# EAGLE schematic threshold (EAGLE 7.5.0)

## Sheet 1 of 4: Sheet1
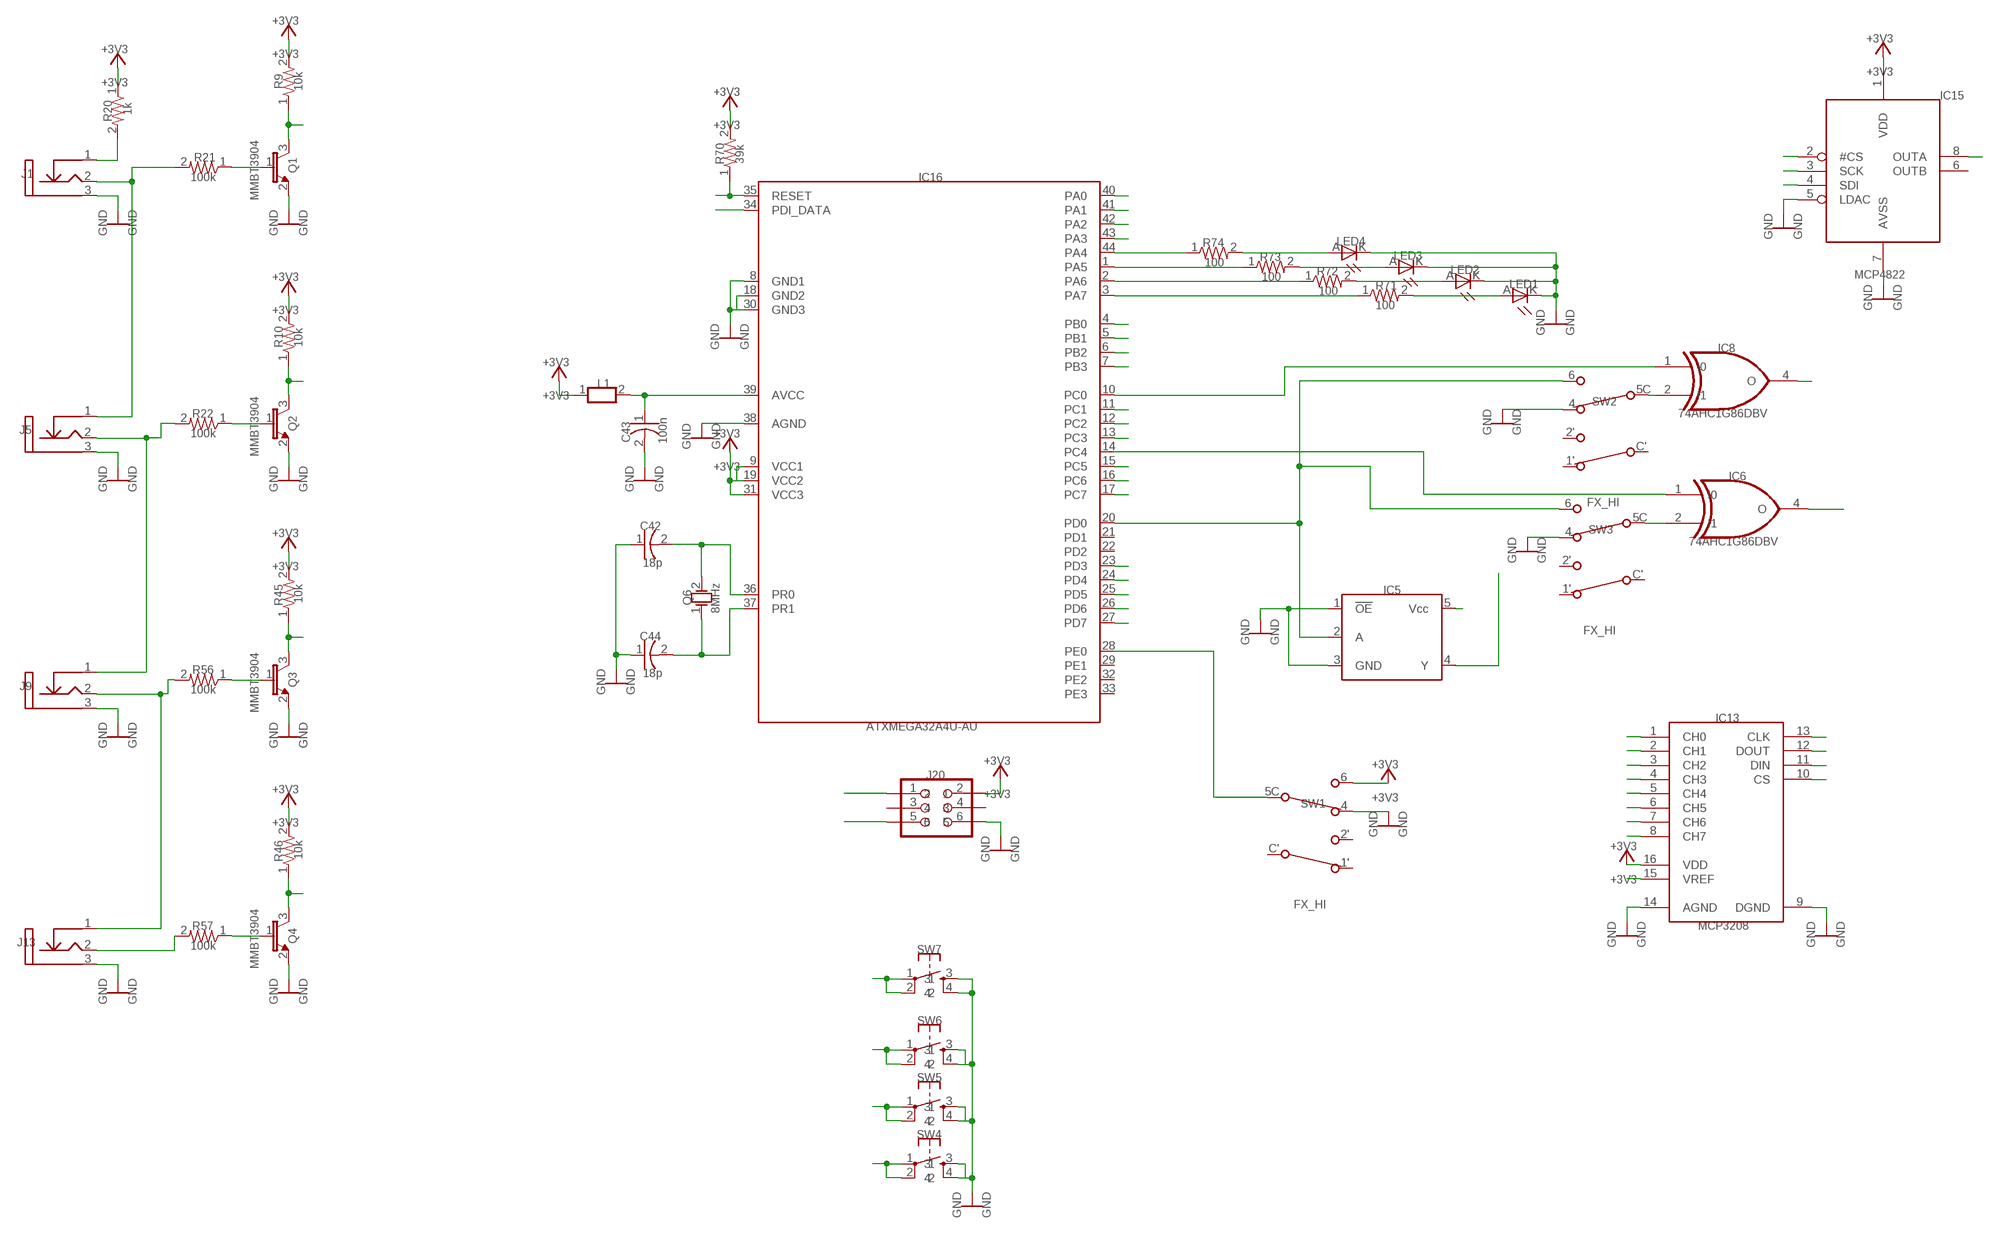
[diagram p0: schematic, sheet 1]

### Parts
C42  18p  C-USC0603_7  [CAP_0603]
C43  100n  C-USC0603  [CAP_0603]
C44  18p  C-USC0603_7  [CAP_0603]
IC5  74AHC1G125GV  [SOT23-5]
IC6  74AHC1G86DBV  [SOT23-5]
IC8  74AHC1G86DBV  [SOT23-5]
IC13  MCP3208  [SO16]
IC15  MCP4822  MCP4822SO08  [SO08]
IC16  ATXMEGA32A4U-AU  AVR_XMEGA_A4_44A  [TQFP44]
J1  THONKICONN  [THONKICONN_JACK]
J5  THONKICONN  [THONKICONN_JACK]
J9  THONKICONN  [THONKICONN_JACK]
J13  THONKICONN  [THONKICONN_JACK]
J20  AVR_SPI_PRG_6PTH  [2X3]
L1  WE-CBF_0603  [0603]
LED1  LED3MM  [LED3MM]
LED2  LED3MM  [LED3MM]
LED3  LED3MM  [LED3MM]
LED4  LED3MM  [LED3MM]
Q1  MMBT3904  MMBT3904LT1-NPN-SOT23-BEC  [SOT23]
Q2  MMBT3904  MMBT3904LT1-NPN-SOT23-BEC  [SOT23]
Q3  MMBT3904  MMBT3904LT1-NPN-SOT23-BEC  [SOT23]
Q4  MMBT3904  MMBT3904LT1-NPN-SOT23-BEC  [SOT23]
Q6  8MHz  TXC_7A_CRYSTAL  [TSC_7A_CRYSTAL]
R9  10k  R-US_R0603  [RES_0603]
R10  10k  R-US_R0603  [RES_0603]
R20  1k  R-US_R0603_31  [RES_0603]
R21  100k  R-US_R0603_33  [RES_0603]
R22  100k  R-US_R0603_33  [RES_0603]
R45  10k  R-US_R0603  [RES_0603]
R46  10k  R-US_R0603  [RES_0603]
R56  100k  R-US_R0603_33  [RES_0603]
R57  100k  R-US_R0603_33  [RES_0603]
R70  39k  R-US_R0603  [RES_0603]
R71  100  R-US_R0603_32  [RES_0603]
R72  100  R-US_R0603_32  [RES_0603]
R73  100  R-US_R0603_32  [RES_0603]
R74  100  R-US_R0603_32  [RES_0603]
SW1  FX_HI  PVB6  [PVB6I]
SW2  FX_HI  PVB6_5  [PVB6I]
SW3  FX_HI  PVB6_5  [PVB6I]
SW4  TAC_SWITCHPTH  [TACTILE-PTH]
SW5  TAC_SWITCHPTH  [TACTILE-PTH]
SW6  TAC_SWITCHPTH  [TACTILE-PTH]
SW7  TAC_SWITCHPTH  [TACTILE-PTH]

### Nets
+3V3: IC5.5(Vcc) IC13.16(VDD) IC15.1(VDD) IC16.9(VCC1) IC16.19(VCC2) IC16.31(VCC3) J20.2 L1.1 R9.2 R10.2 R20.1 R45.2 R46.2 R70.2 SW1.6(C2) ; also sheet 3,4
ADC_MISO: IC13.12(DOUT) IC16.26(PD6)
ADC_MOSI: IC13.11(DIN) IC16.25(PD5)
ADC_SCK: IC13.13(CLK) IC16.27(PD7)
ADC_SS: IC13.10(CS) IC16.23(PD3)
AREF: IC13.15(VREF) ; also sheet 3
CH1: IC13.1(CH0) ; also sheet 2
CH2: IC13.2(CH1) ; also sheet 2
CH3: IC13.5(CH4) ; also sheet 2
CH4: IC13.6(CH5) ; also sheet 2
CH5: IC13.3(CH2) ; also sheet 2
CH6: IC13.4(CH3) ; also sheet 2
CH7: IC13.7(CH6) ; also sheet 2
CH8: IC13.8(CH7) ; also sheet 2
CHANNEL1: IC5.4(Y) ; also sheet 2
CHANNEL2: IC6.4(PART_1:O) ; also sheet 2
CHANNEL3: IC8.4(PART_1:O) ; also sheet 2
CHANNEL4: IC15.8(OUTA) ; also sheet 2
DAC_MOSI: IC15.4(SDI) IC16.17(PC7)
DAC_SCK: IC15.3(SCK) IC16.15(PC5)
DAC_SS: IC15.2(#CS) IC16.16(PC6)
GATE1: IC16.40(PA0) Q1.3(C) R9.1
GATE1_IN: J1.2(Tip) J5.1(TN) R21.2
GATE1_LED: LED4.A R74.2
GATE2: IC16.41(PA1) Q2.3(C) R10.1
GATE2_IN: J5.2(Tip) J9.1(TN) R22.2
GATE2_LED: LED3.A R73.2
GATE3: IC16.42(PA2) Q3.3(C) R45.1
GATE3_IN: J9.2(Tip) J13.1(TN) R56.2
GATE3_LED: LED2.A R72.2
GATE4: IC16.43(PA3) Q4.3(C) R46.1
GATE4_IN: J13.2(Tip) R57.2
GATE4_LED: LED1.A R71.2
GND: C42.1 C43.2 C44.1 IC5.1(!OE!) IC5.3(GND) IC13.9(DGND) IC13.14(AGND) IC15.5(LDAC) IC15.7(AVSS) IC16.8(GND1) IC16.18(GND2) IC16.30(GND3) IC16.38(AGND) J1.3(GND) J5.3(GND) J9.3(GND) J13.3(GND) J20.6 LED1.K(C) LED2.K(C) LED3.K(C) LED4.K(C) Q1.2(E) Q2.2(E) Q3.2(E) Q4.2(E) SW1.4(C3) SW2.4(C3) SW3.4(C3) SW4.3 SW4.4 SW5.3 SW5.4 SW6.3 SW6.4 SW7.3 SW7.4 ; also sheet 2,3,4
MIDI_IN: IC16.12(PC2) ; also sheet 4
N$1: Q1.1(B) R21.1
N$2: Q2.1(B) R22.1
N$3: Q3.1(B) R56.1
N$5: IC16.44(PA4) R74.1
N$6: IC16.1(PA5) R73.1
N$7: IC16.2(PA6) R72.1
N$8: IC16.3(PA7) R71.1
N$12: J1.1(TN) R20.2
N$19: IC6.1(PART_1:I0) IC16.14(PC4)
N$21: IC8.2(PART_1:I1) SW2.5C(C1)
N$24: IC6.2(PART_1:I1) SW3.5C(C1)
N$39: C43.1 IC16.39(AVCC) L1.2
N$41: IC8.1(PART_1:I0) IC16.10(PC0)
N$48: IC5.2(A) IC16.20(PD0) SW2.6(C2) SW3.6(C2)
N$82: C44.2 IC16.37(PR1) Q6.1(OSC1)
N$83: C42.2 IC16.36(PR0) Q6.2(OSC2)
N$40000: Q4.1(B) R57.1
NES_TRIANGLE_CLK: IC16.24(PD4) ; also sheet 4
PDICLK: IC16.35(RESET) J20.5 R70.1
PDIDATA: IC16.34(PDI_DATA) J20.1
SW1: IC16.4(PB0) SW7.1 SW7.2
SW2: IC16.5(PB1) SW6.1 SW6.2
SW3: IC16.6(PB2) SW5.1 SW5.2
SW4: IC16.7(PB3) SW4.1 SW4.2
SW_MIDI_LEARN: IC16.11(PC1) ; also sheet 4
SW_MIDI_MODE: IC16.13(PC3) ; also sheet 4
SYNC_SWITCH: IC16.28(PE0) SW1.5C(C1)
Unconnected: IC15.6(OUTB) IC16.21(PD1) IC16.22(PD2) IC16.29(PE1) IC16.32(PE2) IC16.33(PE3) J20.3 J20.4 SW1.1'(C3) SW1.2'(C2) SW1.C'(C1) SW2.1'(C3) SW2.2'(C2) SW2.C'(C1) SW3.1'(C3) SW3.2'(C2) SW3.C'(C1)

### Notes on the sheet
- +3V3
- +3V3
- +3V3
- +3V3
- +3V3
- +3V3
- R9 | 10k
- +3V3
- IC15
- 1k
- R20 | +3V3
- R21 | R70 | 39k
- 100k | Q1
- J1
- IC16
- MMBT3904
- GND | GND | GND | GND
- GND | GND
- R74 | LED4
- 100 | R73 | LED3
- 100 | MCP4822
- R72 | LED2
- +3V3
- 100 | R71 | LED1
- 100
- +3V3
- GND | GND
- GND | GND
- R10 | 10k | GND | GND
- IC8
- +3V3
- L1
- +3V3
- SW2
- 74AHC1G86DBV
- R22
- 100k | Q2
- J5 | GND | GND
- +3V3
- C43 | 100n
- GND | GND
- MMBT3904
- +3V3
- IC6
- GND | GND | GND | GND | GND | GND
- FX_HI
- C42
- SW3
- +3V3 | 74AHC1G86DBV
- 18p
- +3V3 | GND | GND
- IC5
- R45 | 10k | Q6
- 8MHz
- FX_HI
- C44
- GND | GND
- 18p
- R56
- 100k | Q3
- J9
- GND | GND
- MMBT3904
- ATXMEGA32A4U-AU | IC13
- GND | GND | GND | GND
- +3V3
- +3V3
- J20
- +3V3
- +3V3 | +3V3
- SW1
- +3V3
- GND | GND
- +3V3
- R46 | 10k | GND | GND
- +3V3
- FX_HI
- MCP3208
- R57
- 100k | Q4
- J13 | GND | GND | GND | GND
- SW7
- MMBT3904
- GND | GND | GND | GND
- SW6
- SW5
- SW4
- GND | GND

## Sheet 2 of 4: Sheet2
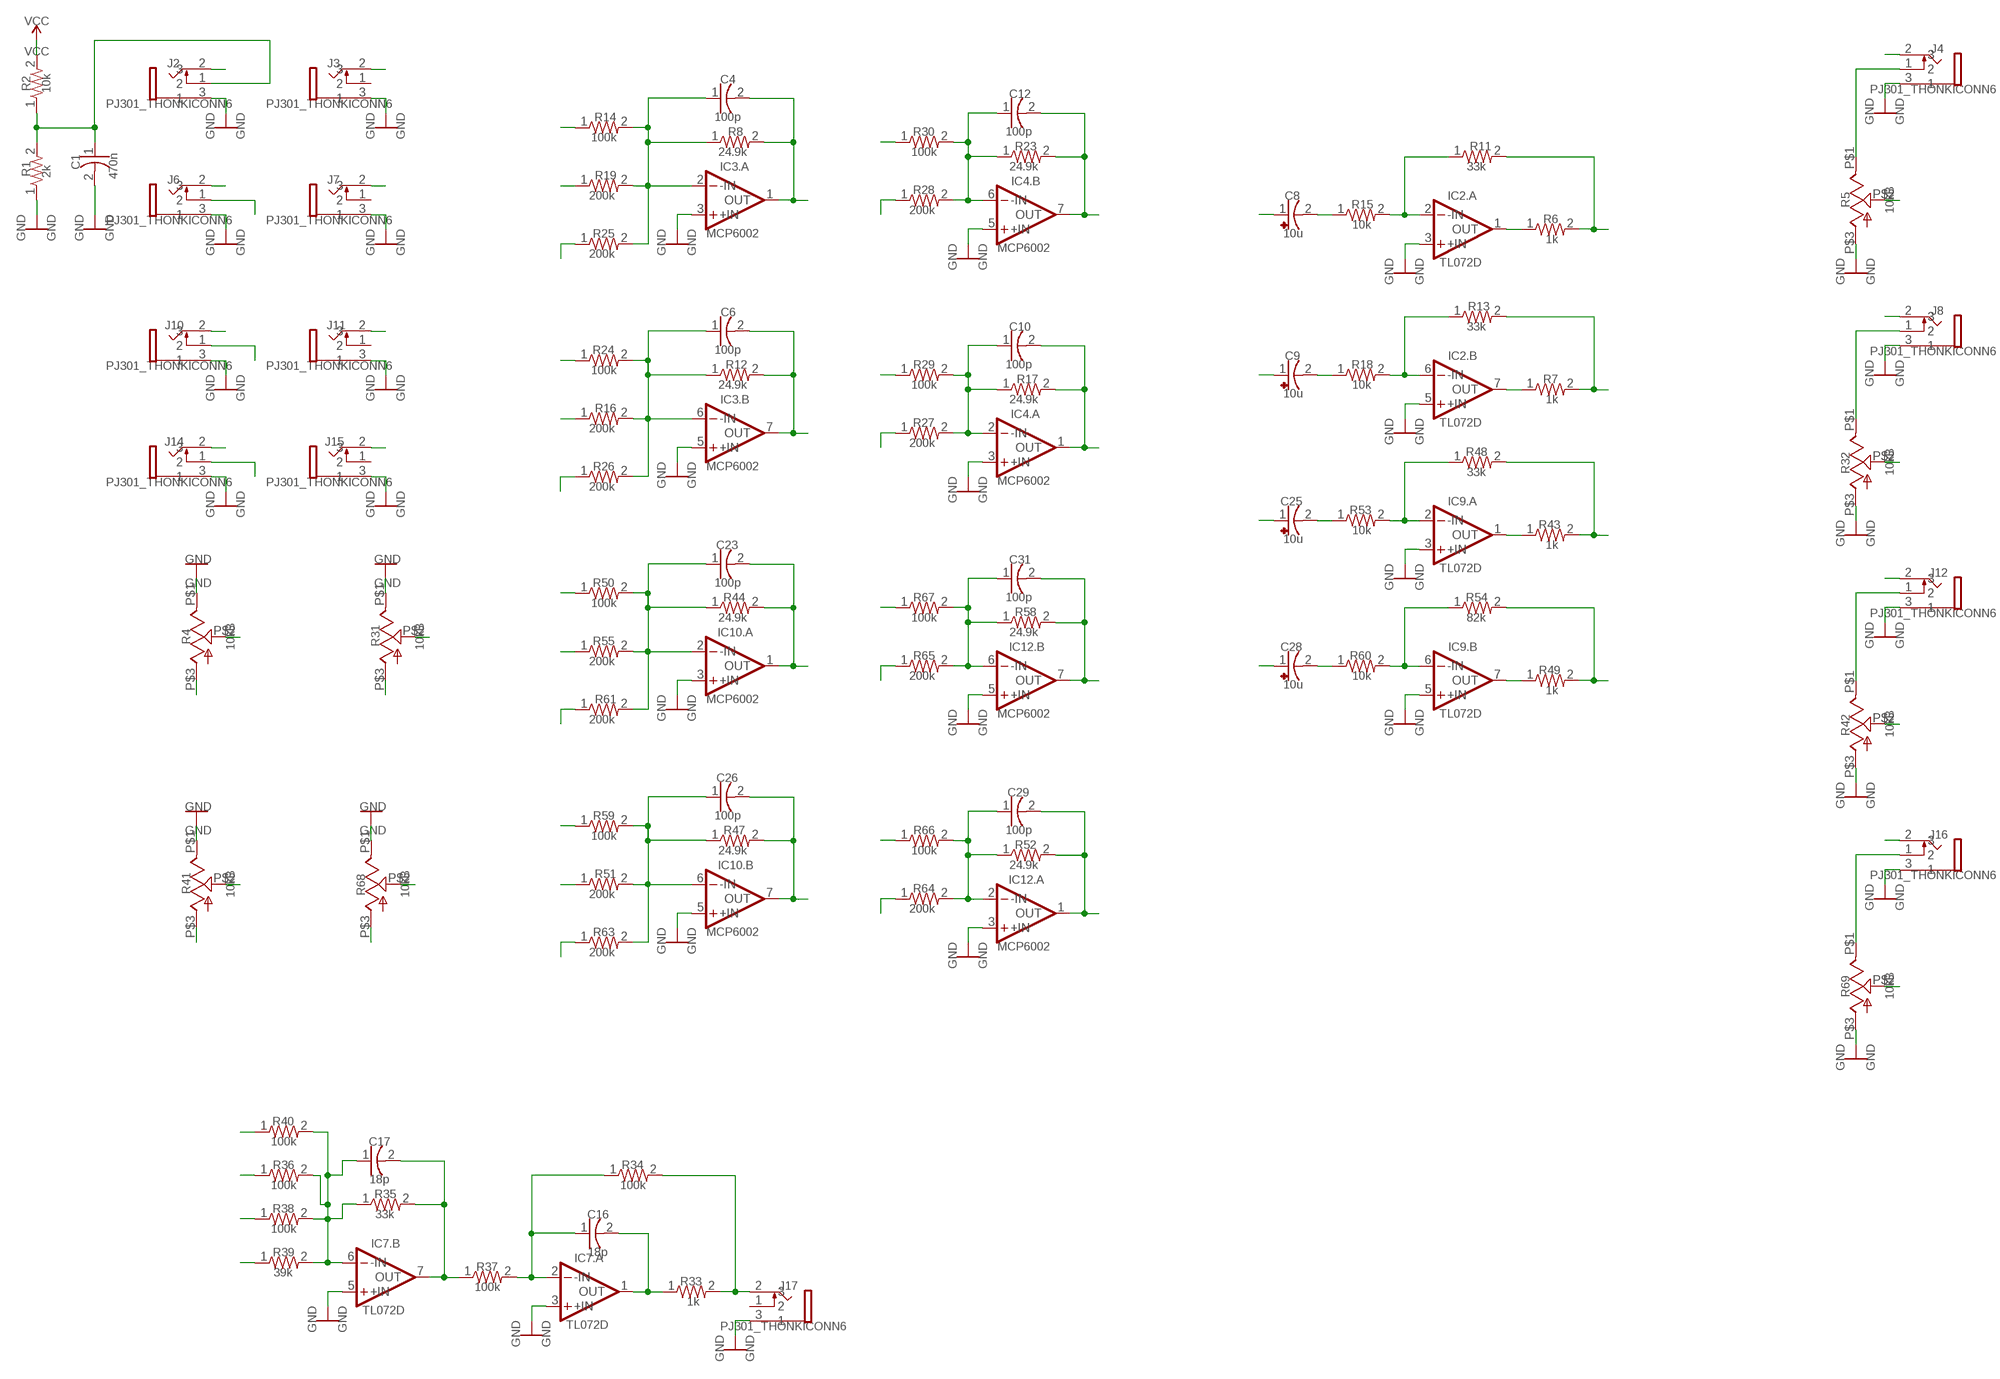
[diagram p1: schematic, sheet 2]

### Parts
C1  470n  C-USC0603  [CAP_0603]
C4  100p  C-USC0603_7  [CAP_0603]
C6  100p  C-USC0603_7  [CAP_0603]
C8  10u  CPOL-USB  [CAP_1206]
C9  10u  CPOL-USB  [CAP_1206]
C10  100p  C-USC0603_7  [CAP_0603]
C12  100p  C-USC0603_7  [CAP_0603]
C16  18p  C-USC0603_7  [CAP_0603]
C17  18p  C-USC0603_7  [CAP_0603]
C23  100p  C-USC0603_7  [CAP_0603]
C25  10u  CPOL-USB  [CAP_1206]
C26  100p  C-USC0603_7  [CAP_0603]
C28  10u  CPOL-USB  [CAP_1206]
C29  100p  C-USC0603_7  [CAP_0603]
C31  100p  C-USC0603_7  [CAP_0603]
IC2  TL072D  [SO08_23]
IC3  MCP6002  TL072D  [SO08_23]
IC4  MCP6002  TL072D  [SO08_23]
IC7  TL072D  [SO08_23]
IC9  TL072D  [SO08_23]
IC10  MCP6002  TL072D  [SO08_23]
IC12  MCP6002  TL072D  [SO08_23]
J2  PJ301_THONKICONN6  [THONKICONN]
J3  PJ301_THONKICONN6  [THONKICONN]
J4  PJ301_THONKICONN6  PJ301_THONKICONN6_1  [THONKICONN]
J6  PJ301_THONKICONN6  [THONKICONN]
J7  PJ301_THONKICONN6  [THONKICONN]
J8  PJ301_THONKICONN6  PJ301_THONKICONN6_1  [THONKICONN]
J10  PJ301_THONKICONN6  [THONKICONN]
J11  PJ301_THONKICONN6  [THONKICONN]
J12  PJ301_THONKICONN6  PJ301_THONKICONN6_1  [THONKICONN]
J14  PJ301_THONKICONN6  [THONKICONN]
J15  PJ301_THONKICONN6  [THONKICONN]
J16  PJ301_THONKICONN6  PJ301_THONKICONN6_1  [THONKICONN]
J17  PJ301_THONKICONN6  PJ301_THONKICONN6_1  [THONKICONN]
R1  2k  R-US_R0603  [RES_0603]
R2  10k  R-US_R0603  [RES_0603]
R4  10kB  POT_USVERTICAL_PS  [ALPS_POT_VERTICAL_PS]
R5  10kB  POT_USVERTICAL_PS  [ALPS_POT_VERTICAL_PS]
R6  1k  R-US_R0603_32  [RES_0603]
R7  1k  R-US_R0603_32  [RES_0603]
R8  24.9k  R-US_R0603_32  [RES_0603]
R11  33k  R-US_R0603_32  [RES_0603]
R12  24.9k  R-US_R0603_32  [RES_0603]
R13  33k  R-US_R0603_32  [RES_0603]
R14  100k  R-US_R0603_32  [RES_0603]
R15  10k  R-US_R0603_32  [RES_0603]
R16  200k  R-US_R0603_32  [RES_0603]
R17  24.9k  R-US_R0603_32  [RES_0603]
R18  10k  R-US_R0603_32  [RES_0603]
R19  200k  R-US_R0603_32  [RES_0603]
R23  24.9k  R-US_R0603_32  [RES_0603]
R24  100k  R-US_R0603_32  [RES_0603]
R25  200k  R-US_R0603_32  [RES_0603]
R26  200k  R-US_R0603_32  [RES_0603]
R27  200k  R-US_R0603_32  [RES_0603]
R28  200k  R-US_R0603_32  [RES_0603]
R29  100k  R-US_R0603_32  [RES_0603]
R30  100k  R-US_R0603_32  [RES_0603]
R31  10kB  POT_USVERTICAL_PS  [ALPS_POT_VERTICAL_PS]
R32  10kB  POT_USVERTICAL_PS  [ALPS_POT_VERTICAL_PS]
R33  1k  R-US_R0603_32  [RES_0603]
R34  100k  R-US_R0603_32  [RES_0603]
R35  33k  R-US_R0603_32  [RES_0603]
R36  100k  R-US_R0603_32  [RES_0603]
R37  100k  R-US_R0603_32  [RES_0603]
R38  100k  R-US_R0603_32  [RES_0603]
R39  39k  R-US_R0603_32  [RES_0603]
R40  100k  R-US_R0603_32  [RES_0603]
R41  10kB  POT_USVERTICAL_PS  [ALPS_POT_VERTICAL_PS]
R42  10kB  POT_USVERTICAL_PS  [ALPS_POT_VERTICAL_PS]
R43  1k  R-US_R0603_32  [RES_0603]
R44  24.9k  R-US_R0603_32  [RES_0603]
R47  24.9k  R-US_R0603_32  [RES_0603]
R48  33k  R-US_R0603_32  [RES_0603]
R49  1k  R-US_R0603_32  [RES_0603]
R50  100k  R-US_R0603_32  [RES_0603]
R51  200k  R-US_R0603_32  [RES_0603]
R52  24.9k  R-US_R0603_32  [RES_0603]
R53  10k  R-US_R0603_32  [RES_0603]
R54  82k  R-US_R0603_32  [RES_0603]
R55  200k  R-US_R0603_32  [RES_0603]
R58  24.9k  R-US_R0603_32  [RES_0603]
R59  100k  R-US_R0603_32  [RES_0603]
R60  10k  R-US_R0603_32  [RES_0603]
R61  200k  R-US_R0603_32  [RES_0603]
R63  200k  R-US_R0603_32  [RES_0603]
R64  200k  R-US_R0603_32  [RES_0603]
R65  200k  R-US_R0603_32  [RES_0603]
R66  100k  R-US_R0603_32  [RES_0603]
R67  100k  R-US_R0603_32  [RES_0603]
R68  10kB  POT_USVERTICAL_PS  [ALPS_POT_VERTICAL_PS]
R69  10kB  POT_USVERTICAL_PS  [ALPS_POT_VERTICAL_PS]

### Nets
AREF_-10: R4.P$3(A) R25.1 R26.1 R27.1 R28.1 R31.P$3(A) R41.P$3(A) R61.1 R63.1 R64.1 R65.1 R68.P$3(A) ; also sheet 3
CH1: C4.2 IC3.1(PART_A:OUT) R8.2 ; also sheet 1
CH2: C6.2 IC3.7(PART_B:OUT) R12.2 ; also sheet 1
CH3: C23.2 IC10.1(PART_A:OUT) R44.2 ; also sheet 1
CH4: C26.2 IC10.7(PART_B:OUT) R47.2 ; also sheet 1
CH5: C12.2 IC4.7(PART_B:OUT) R23.2 ; also sheet 1
CH6: C10.2 IC4.1(PART_A:OUT) R17.2 ; also sheet 1
CH7: C31.2 IC12.7(PART_B:OUT) R58.2 ; also sheet 1
CH8: C29.2 IC12.1(PART_A:OUT) R52.2 ; also sheet 1
CHANNEL1: C8.1(+) ; also sheet 1
CHANNEL1_BUFFERED: J4.2 R6.2 R11.2
CHANNEL1_RETURN: R5.P$2(S) R40.1
CHANNEL2: C9.1(+) ; also sheet 1
CHANNEL2_BUFFERED: J8.2 R7.2 R13.2
CHANNEL2_RETURN: R32.P$2(S) R36.1
CHANNEL3: C25.1(+) ; also sheet 1
CHANNEL3_BUFFERED: J12.2 R43.2 R48.2
CHANNEL3_RETURN: R38.1 R42.P$2(S)
CHANNEL4: C28.1(+) ; also sheet 1
CHANNEL4_BUFFERED: J16.2 R49.2 R54.2
CHANNEL4_RETURN: R39.1 R69.P$2(S)
COARSE1: R4.P$2(S) R19.1
COARSE2: R16.1 R31.P$2(S)
COARSE3: R41.P$2(S) R55.1
COARSE4: R51.1 R68.P$2(S)
CV1: J2.2 J6.1 R14.1
CV2: J6.2 J10.1 R24.1
CV3: J10.2 J14.1 R50.1
CV4: J14.2 R59.1
FM1: J3.2 R30.1
FM2: J7.2 R29.1
FM3: J11.2 R67.1
FM4: J15.2 R66.1
GND: C1.2 IC2.3(PART_A:+IN) IC2.5(PART_B:+IN) IC3.3(PART_A:+IN) IC3.5(PART_B:+IN) IC4.3(PART_A:+IN) IC4.5(PART_B:+IN) IC7.3(PART_A:+IN) IC7.5(PART_B:+IN) IC9.3(PART_A:+IN) IC9.5(PART_B:+IN) IC10.3(PART_A:+IN) IC10.5(PART_B:+IN) IC12.3(PART_A:+IN) IC12.5(PART_B:+IN) J2.3 J3.3 J4.3 J6.3 J7.3 J8.3 J10.3 J11.3 J12.3 J14.3 J15.3 J16.3 J17.3 R1.1 R4.P$1(E) R5.P$3(A) R31.P$1(E) R32.P$3(A) R41.P$1(E) R42.P$3(A) R68.P$1(E) R69.P$3(A) ; also sheet 1,3,4
MIX: J17.2 R33.2 R34.2
N$4: J8.1 R32.P$1(E)
N$9: C23.1 IC10.2(PART_A:-IN) R44.1 R50.2 R55.2 R61.2
N$11: C10.1 IC4.2(PART_A:-IN) R17.1 R27.2 R29.2
N$13: C26.1 IC10.6(PART_B:-IN) R47.1 R51.2 R59.2 R63.2
N$15: C31.1 IC12.6(PART_B:-IN) R58.1 R65.2 R67.2
N$18: C29.1 IC12.2(PART_A:-IN) R52.1 R64.2 R66.2
N$20: C8.2(-) R15.1
N$22: IC2.2(PART_A:-IN) R11.1 R15.2
N$23: IC2.1(PART_A:OUT) R6.1
N$25: C9.2(-) R18.1
N$26: IC2.6(PART_B:-IN) R13.1 R18.2
N$27: IC2.7(PART_B:OUT) R7.1
N$28: C25.2(-) R53.1
N$29: C12.1 IC4.6(PART_B:-IN) R23.1 R28.2 R30.2
N$30: IC9.2(PART_A:-IN) R48.1 R53.2
N$31: IC9.1(PART_A:OUT) R43.1
N$32: C28.2(-) R60.1
N$33: IC9.6(PART_B:-IN) R54.1 R60.2
N$34: IC9.7(PART_B:OUT) R49.1
N$35: C17.1 IC7.6(PART_B:-IN) R35.1 R36.2 R38.2 R39.2 R40.2
N$36: C16.1 IC7.2(PART_A:-IN) R34.1 R37.2
N$37: C16.2 IC7.1(PART_A:OUT) R33.1
N$40: J4.1 R5.P$1(E)
N$42: C17.2 IC7.7(PART_B:OUT) R35.2 R37.1
N$43: J12.1 R42.P$1(E)
N$44: J16.1 R69.P$1(E)
N$45: C6.1 IC3.6(PART_B:-IN) R12.1 R16.2 R24.2 R26.2
N$46: C1.1 J2.1 R1.2 R2.1
N$50: C4.1 IC3.2(PART_A:-IN) R8.1 R14.2 R19.2 R25.2
VCC: R2.2 ; also sheet 3,4
Unconnected: J3.1 J7.1 J11.1 J15.1 J17.1

### Notes on the sheet
- VCC
- VCC
- J4
- J2 | J3
- C4 | PJ301_THONKICONN6
- R2 | 10k
- PJ301_THONKICONN6 | PJ301_THONKICONN6 | C12
- 100p
- R14 | GND | GND
- 100p
- 100k | R8 | R30
- GND | GND | GND | GND
- 24.9k | 100k | R23 | R11
- 24.9k | 33k
- C1 | IC3.A
- R1 | 2k | 470n
- R19
- J6 | J7 | IC4.B
- 200k | R28
- C8 | IC2.A
- 200k | R15 | R5
- PJ301_THONKICONN6 | PJ301_THONKICONN6 | 10kB
- 10k | R6
- MCP6002 | 10u
- R25 | 1k
- GND | GND | GND | GND | MCP6002
- 200k
- GND | GND | GND | GND | GND | GND | TL072D
- GND | GND
- GND | GND | GND | GND
- R13
- C6 | J8
- 33k
- J10 | J11 | C10
- 100p | PJ301_THONKICONN6
- R24
- PJ301_THONKICONN6 | PJ301_THONKICONN6 | 100p | C9 | IC2.B
- 100k | R12 | R29 | R18
- 24.9k | 100k | R17 | 10k | R7
- 10u | GND | GND
- 24.9k | 1k
- GND | GND | GND | GND | IC3.B
- R16
- IC4.A | TL072D
- 200k | R27
- 200k
- J14 | J15 | GND | GND
- R48
- MCP6002
- R26 | 33k
- MCP6002 | R32 | 10kB
- PJ301_THONKICONN6 | PJ301_THONKICONN6
- 200k
- GND | GND
- GND | GND | C25 | IC9.A
- GND | GND | GND | GND | R53
- 10k | R43
- 10u
- 1k
- C23 | GND | GND
- GND | GND | C31 | TL072D
- GND | GND | 100p | J12
- R50 | GND | GND
- 100p
- 100k | R44 | R67 | R54
- PJ301_THONKICONN6
- 24.9k | 100k | R58 | 82k
- 24.9k
- IC10.A
- R4 | R31 | R55
- 10kB | 10kB | IC12.B | C28 | IC9.B | GND | GND
- 200k | R65 | R60
- 200k | 10k | R49
- 10u
- 1k
- MCP6002
- R61
- MCP6002 | TL072D
- 200k
- GND | GND
- GND | GND | GND | GND | R42 | 10kB
- C26
- C29
- GND | GND | 100p | GND | GND
- R59
- GND | GND | 100p
- 100k | R47 | R66
- J16
- 24.9k | 100k | R52
- 24.9k
- IC10.B | PJ301_THONKICONN6
- R51
- IC12.A
- 200k | R64
- R41 | R68
- 10kB | 10kB
- 200k
- GND | GND
- MCP6002
- R63
- MCP6002
- 200k
- GND | GND
- GND | GND
- R69 | 10kB
- GND | GND
- R40
- 100k
- C17
- R36 | R34
- 18p
- 100k | 100k
- R35
- R38 | 33k
- C16
- 100k
- IC7.B | 18p
- R39
- IC7.A
- 39k | R37
- 100k | R33
- J17
- 1k
- TL072D
- TL072D | PJ301_THONKICONN6
- GND | GND
- GND | GND
- GND | GND

## Sheet 3 of 4: Sheet3
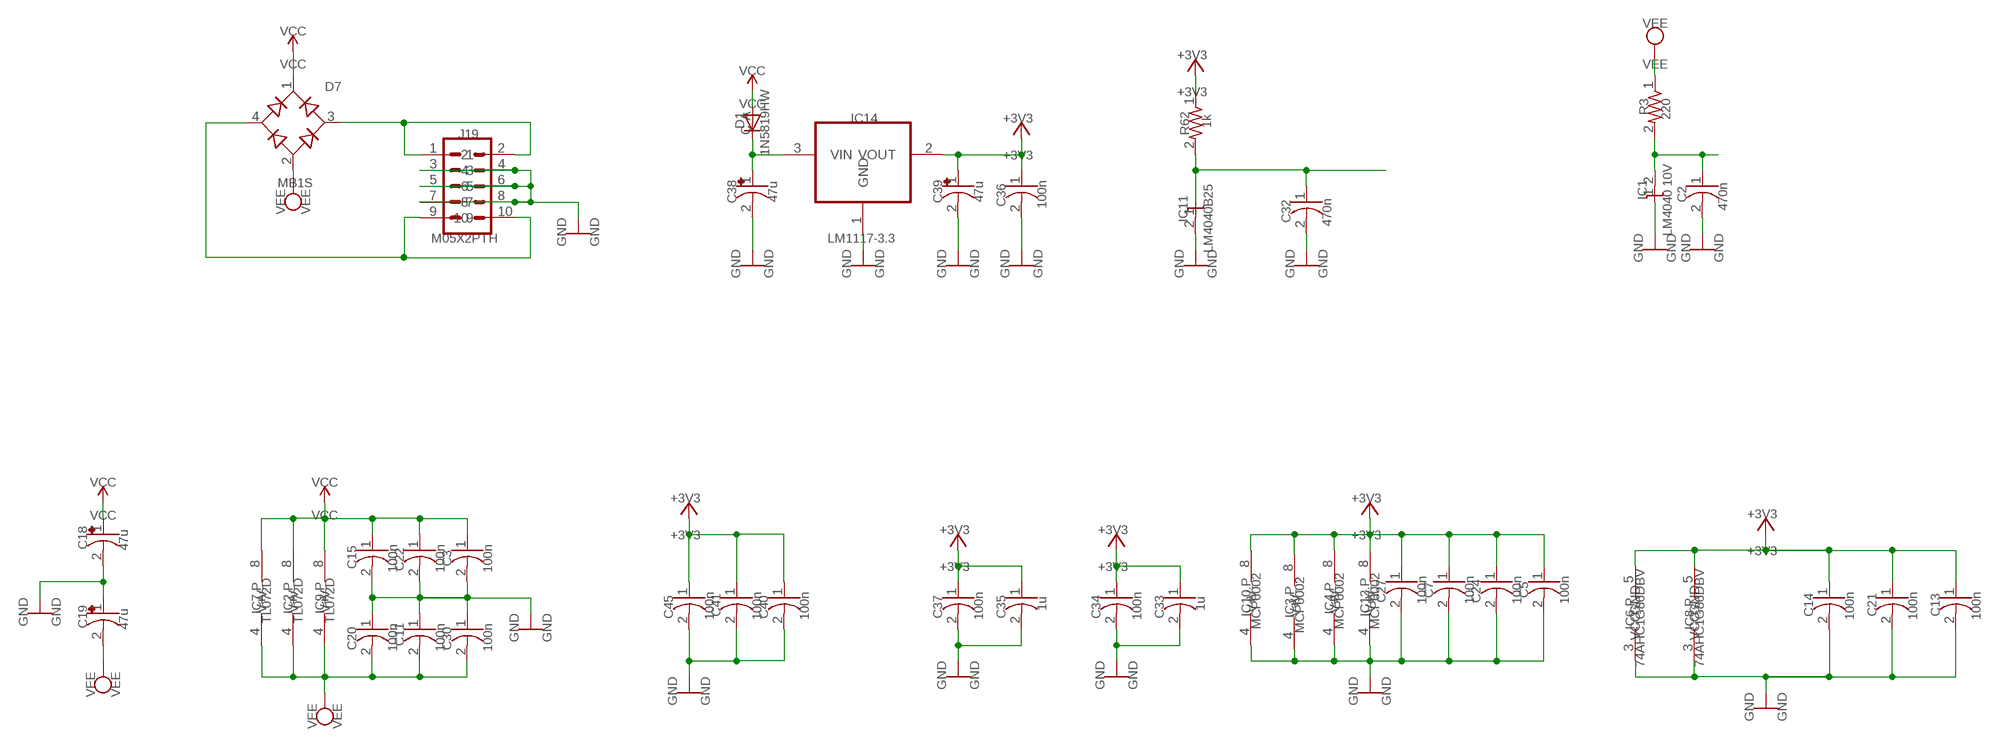
[diagram p2: schematic, sheet 3]

### Parts
C2  470n  C-USC0603  [CAP_0603]
C3  100n  C-USC0603  [CAP_0603]
C5  100n  C-USC0603  [CAP_0603]
C7  100n  C-USC0603  [CAP_0603]
C11  100n  C-USC0603  [CAP_0603]
C13  100n  C-USC0603  [CAP_0603]
C14  100n  C-USC0603  [CAP_0603]
C15  100n  C-USC0603  [CAP_0603]
C18  47u  EEE-FT1V470AR  [CAPAE-5.3X5.3H7]
C19  47u  EEE-FT1V470AR  [CAPAE-5.3X5.3H7]
C20  100n  C-USC0603  [CAP_0603]
C21  100n  C-USC0603  [CAP_0603]
C22  100n  C-USC0603  [CAP_0603]
C24  100n  C-USC0603  [CAP_0603]
C27  100n  C-USC0603  [CAP_0603]
C30  100n  C-USC0603  [CAP_0603]
C32  470n  C-USC0603  [CAP_0603]
C33  1u  C-USC0603  [CAP_0603]
C34  100n  C-USC0603  [CAP_0603]
C35  1u  C-USC0603  [CAP_0603]
C36  100n  C-USC0603  [CAP_0603]
C37  100n  C-USC0603  [CAP_0603]
C38  47u  EEE-FT1V470AR  [CAPAE-5.3X5.3H7]
C39  47u  EEE-FT1V470AR  [CAPAE-5.3X5.3H7]
C40  100n  C-USC0603  [CAP_0603]
C41  100n  C-USC0603  [CAP_0603]
C45  100n  C-USC0603  [CAP_0603]
D1  1N5819HW  DIODE-SOD123  [SOD123]
D7  MB1S  [SOP-4/6.5X2.54]
IC1  LM4040 10V  LM4041C12DBZ  [SOT23]
IC11  LM4040B25  LM4041B12DBZ  [SOT23]
IC14  LM1117-3.3  REG1117  [SOT223]
J19  M05X2PTH  [AVR_ICSP]
R3  220  R-US_R0603_31  [RES_0603]
R62  1k  R-US_R0603_31  [RES_0603]

### Nets
+3V3: C5.1 C7.1 C13.1 C14.1 C21.1 C24.1 C27.1 C33.1 C34.1 C35.1 C36.1 C37.1 C39.1(+) C40.1 C41.1 C45.1 IC3.8(PART_P:V+) IC4.8(PART_P:V+) IC6.5(PART_P:VCC) IC8.5(PART_P:VCC) IC10.8(PART_P:V+) IC12.8(PART_P:V+) IC14.2(VOUT) R62.1 ; also sheet 1,4
AREF: C32.1 IC11.1(C) R62.2 ; also sheet 1
AREF_-10: C2.1 IC1.2(A) R3.2 ; also sheet 2
GND: C2.2 C3.2 C5.2 C7.2 C11.1 C13.2 C14.2 C15.2 C18.2(-) C19.1(+) C20.1 C21.2 C22.2 C24.2 C27.2 C30.1 C32.2 C33.2 C34.2 C35.2 C36.2 C37.2 C38.2(-) C39.2(-) C40.2 C41.2 C45.2 IC1.1(C) IC3.4(PART_P:V-) IC4.4(PART_P:V-) IC6.3(PART_P:GND) IC8.3(PART_P:GND) IC10.4(PART_P:V-) IC11.2(A) IC12.4(PART_P:V-) IC14.1(GND) J19.3 J19.4 J19.5 J19.6 J19.7 J19.8 ; also sheet 1,2,4
N$38: C38.1(+) D1.C IC14.3(VIN)
Net_101: D7.3(AC2) J19.1 J19.2
Net_139: D7.4(AC1) J19.9 J19.10
VCC: C3.1 C15.1 C18.1(+) C22.1 D1.A D7.1(+) IC2.8(PART_P:V+) IC7.8(PART_P:V+) IC9.8(PART_P:V+) ; also sheet 2,4
VEE: C11.2 C19.2(-) C20.2 C30.2 D7.2(-) IC2.4(PART_P:V-) IC7.4(PART_P:V-) IC9.4(PART_P:V-) R3.1 ; also sheet 4

### Notes on the sheet
- VEE
- VCC
- VCC | +3V3 | VEE
- VCC
- +3V3
- D7
- VCC
- R3
- IC14 | +3V3 | 220
- D1 | 1k
- J19 | R62
- +3V3
- 1N5819HW
- MB1S
- C38 | 47u | C39 | 47u | IC1 | C2
- C36 | 100n
- 470n
- VEE | VEE
- IC11 | C32
- 470n
- M05X2PTH | LM1117-3.3 | LM4040 10V
- GND | GND
- LM4040B25
- GND | GND | GND | GND
- GND | GND | GND | GND | GND | GND | GND | GND | GND | GND | GND | GND
- VCC | VCC
- +3V3 | +3V3
- VCC | VCC
- +3V3
- +3V3 | +3V3
- +3V3 | +3V3
- C18 | +3V3
- 47u
- +3V3 | +3V3
- C15 | C3
- 100n | C22 | 100n | 100n
- C7 | C5
- C27 | 100n | 100n | C24 | 100n | 100n
- IC7.P | IC2.P | IC9.P | 1u | 1u | IC4.P
- C45 | C41 | C40 | C37 | C35 | C34 | C33 | IC10.P | IC3.P | IC12.P | C14 | C21 | C13
- TL072D | TL072D | TL072D | 100n | 100n | 100n | 100n | 100n | 100n | 100n | 100n
- GND | GND | C19 | 47u | MCP6002 | MCP6002 | MCP6002 | IC6.P | IC8.P
- MCP6002
- GND | GND
- C11
- C20 | 100n | 100n | C30 | 100n
- 74AHC1G86DBV | 74AHC1G86DBV
- GND | GND | GND | GND
- VEE | VEE
- GND | GND | GND | GND
- GND | GND
- VEE | VEE

## Sheet 4 of 4: xpand
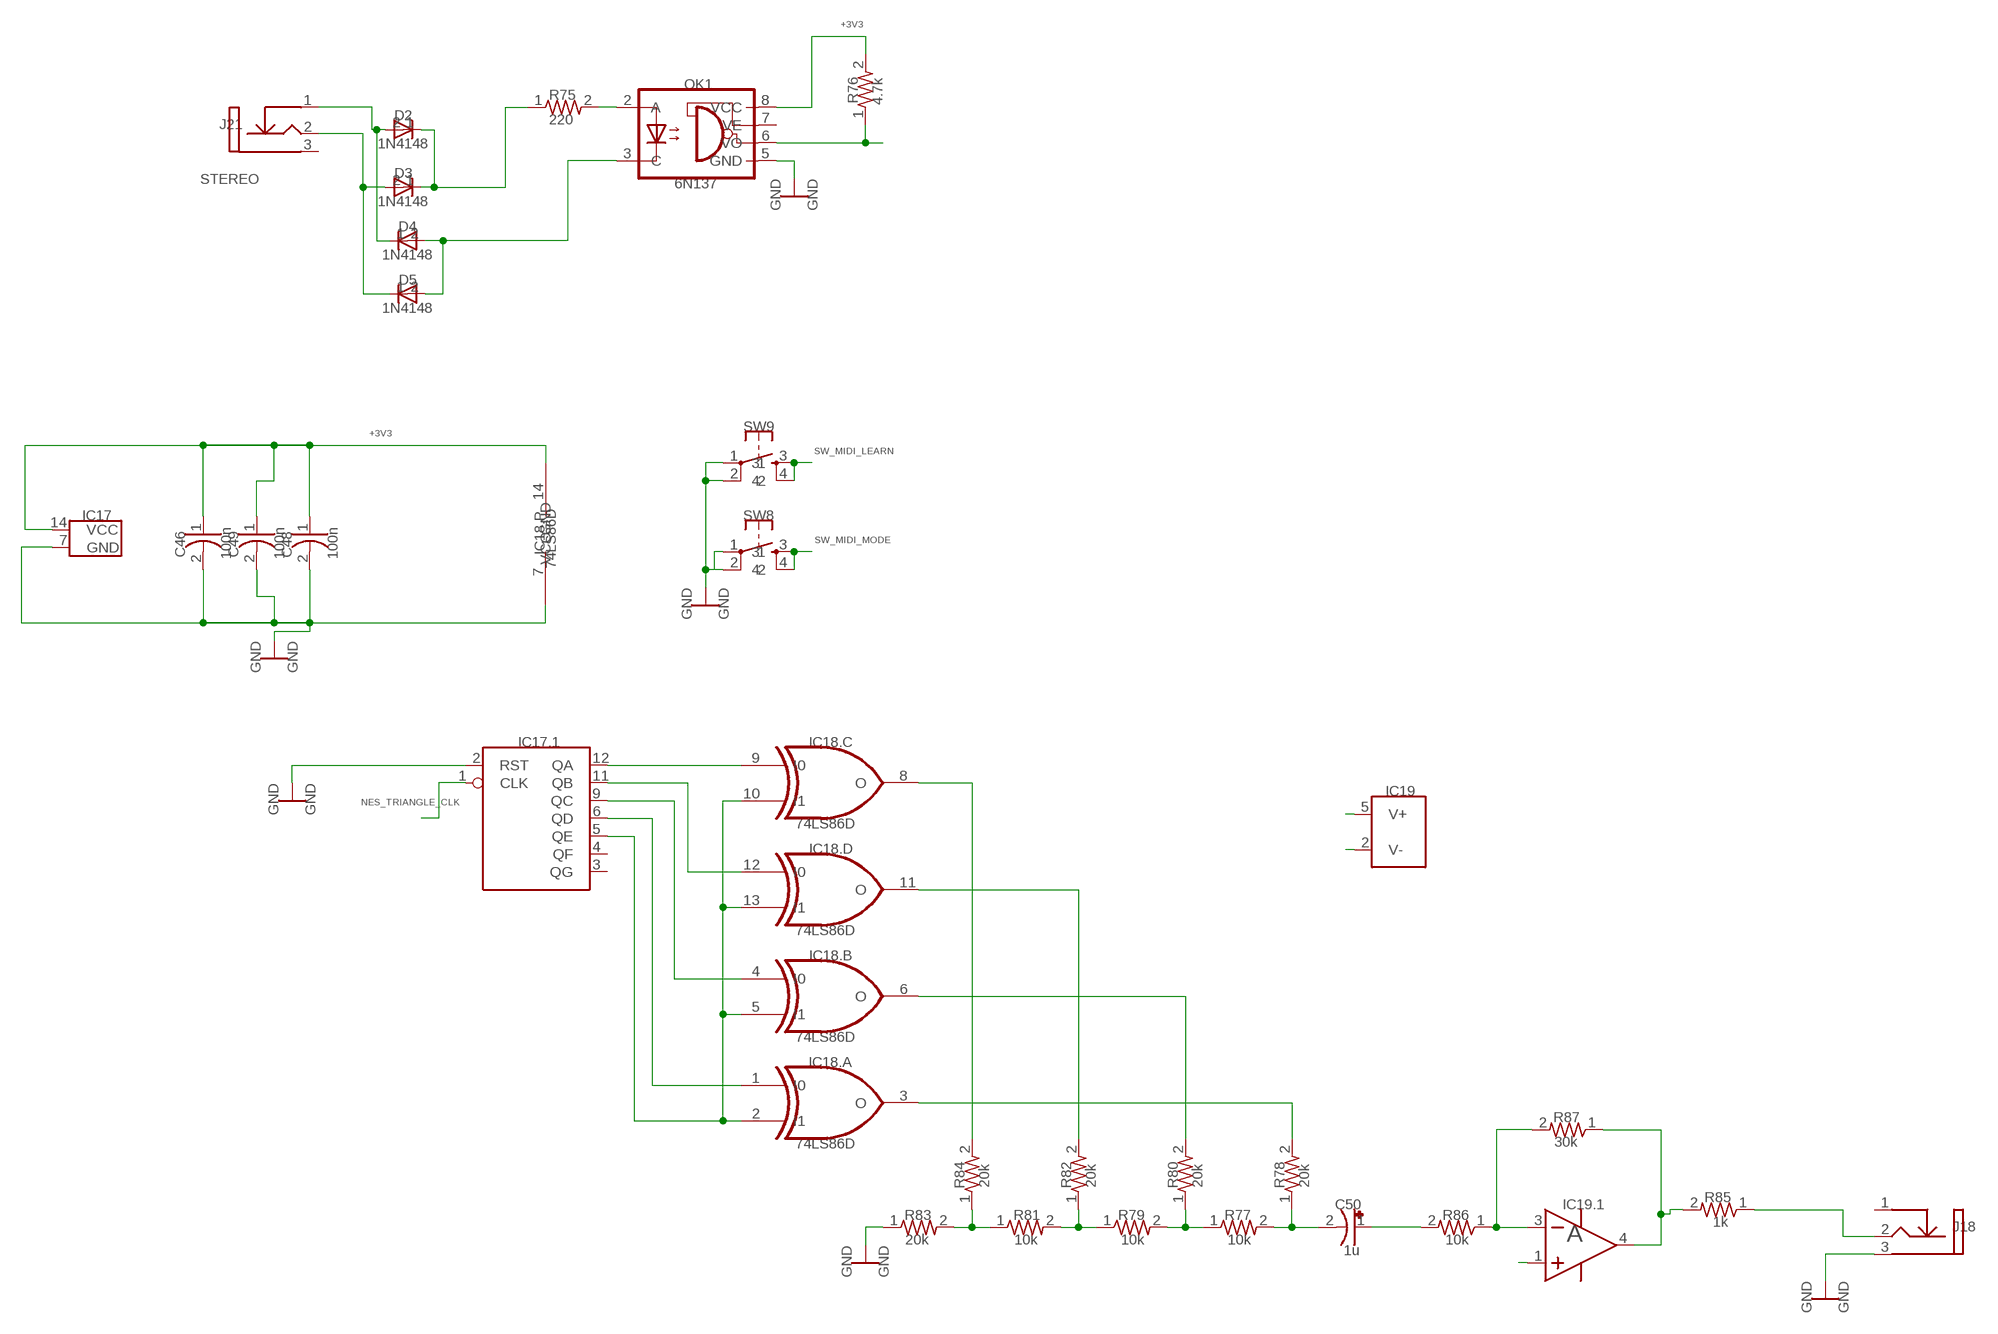
[diagram p3: schematic, sheet 4]

### Parts
C46  100n  C-USC0603  [CAP_0603]
C48  100n  C-USC0603  [CAP_0603]
C49  100n  C-USC0603  [CAP_0603]
C50  1u  CPOL-USB_26  [CAP_0805]
D2  1N4148  DIODE-SOD123_16  [SOD-123F]
D3  1N4148  DIODE-SOD123_16  [SOD-123F]
D4  1N4148  DIODE-SOD123_16  [SOD-123F]
D5  1N4148  DIODE-SOD123_16  [SOD-123F]
IC17  M74HC4024M1R  [SOIC-14/150MIL]
IC18  74LS86D  [SOIC-14/150MIL]
IC19  LM321MF  [SOT23-5]
J18  THONKICONN_35  [THONKICONN_JACK]
J21  STEREO  THONKICONN  [THONKICONN_JACK]
OK1  6N137  6N137SMT  [SOIC-8/150MIL]
R75  220  R-US_R0603_32  [RES_0603]
R76  4.7k  R-US_R0603  [RES_0603]
R77  10k  R-US_R0603_32  [RES_0603]
R78  20k  R-US_R0603  [RES_0603]
R79  10k  R-US_R0603_32  [RES_0603]
R80  20k  R-US_R0603  [RES_0603]
R81  10k  R-US_R0603_32  [RES_0603]
R82  20k  R-US_R0603  [RES_0603]
R83  20k  R-US_R0603_32  [RES_0603]
R84  20k  R-US_R0603  [RES_0603]
R85  1k  R-US_R0603_33  [RES_0603]
R86  10k  R-US_R0603_33  [RES_0603]
R87  30k  R-US_R0603_33  [RES_0603]
SW8  TAC_SWITCHPTH  [TACTILE-PTH]
SW9  TAC_SWITCHPTH  [TACTILE-PTH]

### Nets
+3V3: C46.1 C48.1 C49.1 IC17.14(VCC_AND_GND:VCC) IC18.14(PART_P:VCC) OK1.8(VCC) R76.2 ; also sheet 1,3
GND: C46.2 C48.2 C49.2 IC17.2(PART_1:RST) IC17.7(VCC_AND_GND:GND) IC18.7(PART_P:GND) IC19.1(PART_1:IN+) J18.3(GND) OK1.5(GND) R83.1 SW8.1 SW8.2 SW9.1 SW9.2 ; also sheet 1,2,3
MIDI_IN: OK1.6(VO) R76.1 ; also sheet 1
N$49: IC17.5(PART_1:QE) IC18.2(PART_A:I1) IC18.5(PART_B:I1) IC18.10(PART_C:I1) IC18.13(PART_D:I1)
N$51: IC17.11(PART_1:QB) IC18.12(PART_D:I0)
N$52: IC17.12(PART_1:QA) IC18.9(PART_C:I0)
N$56: IC17.6(PART_1:QD) IC18.1(PART_A:I0)
N$58: R81.1 R83.2 R84.1
N$59: R79.1 R81.2 R82.1
N$60: R77.1 R79.2 R80.1
N$61: C50.2(-) R77.2 R78.1
N$64: J18.2(Tip) R85.1
NES_TRIANGLE_CLK: IC17.1(PART_1:CLK) ; also sheet 1
Net_0: IC19.3(PART_1:IN-) R86.1 R87.2
Net_1: C50.1(+) R86.2
Net_56: D4.2(A) D5.2(A) OK1.3(C)
Net_57: D2.1(C) D3.1(C) R75.1
Net_113: D2.2(A) D4.1(C) J21.1(TN)
Net_131: IC18.6(PART_B:O) R80.2
Net_132: IC18.3(PART_A:O) R78.2
Net_133: IC18.11(PART_D:O) R82.2
Net_134: IC18.8(PART_C:O) R84.2
Net_135: IC19.4(PART_1:OUT) R85.2 R87.1
Net_136: D3.2(A) D5.1(C) J21.2(Tip)
Net_137: OK1.2(A) R75.2
Net_138: IC17.9(PART_1:QC) IC18.4(PART_B:I0)
SW_MIDI_LEARN: SW9.3 SW9.4 ; also sheet 1
SW_MIDI_MODE: SW8.3 SW8.4 ; also sheet 1
VCC: IC19.5(VCC_AND_GND:V+) ; also sheet 2,3
VEE: IC19.2(VCC_AND_GND:V-) ; also sheet 3
Unconnected: IC17.3(PART_1:QG) IC17.4(PART_1:QF) J18.1(TN) J21.3(GND) OK1.7(VE)

### Notes on the sheet
- +3V3
- OK1
- R75 | R76
- 4.7k
- 220
- D2
- J21
- 1N4148
- STEREO
- D3 | 6N137
- 1N4148
- GND | GND
- D4
- 1N4148
- D5
- 1N4148
- +3V3 | SW9
- SW_MIDI_LEARN
- IC17 | SW8
- SW_MIDI_MODE
- C46 | 100n | C49 | 100n | C48 | 100n | IC18.P
- 74LS86D
- GND | GND
- GND | GND
- IC17.1 | IC18.C
- NES_TRIANGLE_CLK | IC19
- GND | GND | 74LS86D
- IC18.D
- 74LS86D
- IC18.B
- 74LS86D
- IC18.A
- R87
- 74LS86D | 30k
- R84 | 20k | R82 | 20k | R80 | 20k | R78 | 20k
- R85
- C50 | IC19.1
- R83 | R81 | R79 | R77 | R86 | 1k
- A
- 20k | 10k | 10k | 10k | 10k | J18
- 1u
- GND | GND
- GND | GND

## Library data of the parts
C1 C2 C32 = common:C-USC0603
C3 C5 C7 C11 C13-C15 C20-C22 C24 C27 C30 C33-C37 C40 C41 C43 C45 C46 C48 C49 = common:C-USC0603; VALUE: 470n
C4 C6 C10 C12 C23 C26 C29 C31 = common:C-USC0603_7
C8 C9 C25 C28 = common:CPOL-USB
C16 C17 C42 C44 = common:C-USC0603_7; VALUE: 100p
C18 C19 C38 C39 = common:EEE-FT1V470AR
C50 = common:CPOL-USB_26
D1 = common:DIODE-SOD123
D2-D5 = common:DIODE-SOD123_16
D7 = common:MB1S
IC1 = common:LM4041C12DBZ
IC2 IC7 IC9 = common:TL072D
IC3 IC4 IC10 IC12 = common:TL072D; VALUE: TL072D
IC5 = common:74AHC1G125GV; DATASHEET: http://datasheets.diptrace.com/philips-nxp/74AHC_AHCT1G125.pdf; MANUFACTURER: NXP-Philips
IC6 IC8 = common:74AHC1G86DBV
IC11 = common:LM4041B12DBZ
IC13 = common:MCP3208
IC14 = common:REG1117
IC15 = common:MCP4822SO08
IC16 = common:AVR_XMEGA_A4_44A
IC17 = common:M74HC4024M1R; DATASHEET: http://datasheets.diptrace.com/st_micro/CD00000314.pdf; MANUFACTURER: ST Microelectronics
IC18 = common:74LS86D
IC19 = common:LM321MF; DATASHEET: http://www.st.com/internet/com/TECHNICAL_RESOURCES/TECHNICAL_LITERATURE/DATASHEET/CD00000489.pdf
J1 J5 J9 J13 J21 = common:THONKICONN
J2 J3 J6 J7 J10 J11 J14 J15 = common:PJ301_THONKICONN6
J4 J8 J12 J16 J17 = common:PJ301_THONKICONN6_1
J18 = common:THONKICONN_35
J19 = common:M05X2PTH
J20 = common:AVR_SPI_PRG_6PTH
L1 = common:WE-CBF_0603
LED1-LED4 = common:LED3MM
OK1 = common:6N137SMT
Q1-Q4 = common:MMBT3904LT1-NPN-SOT23-BEC
Q6 = common:TXC_7A_CRYSTAL; DATASHEET: http://datasheets.diptrace.com/crystals/12SMX.pdf
R1 = common:R-US_R0603
R2 R9 R10 R45 R46 R70 R76 R78 R80 R82 R84 = common:R-US_R0603; VALUE: 2k
R3 = common:R-US_R0603_31
R4 R5 R31 R32 R41 R42 R68 R69 = common:POT_USVERTICAL_PS
R6 R7 R33 R43 R49 = common:R-US_R0603_32
R8 R11-R19 R23-R30 R34-R40 R44 R47 R48 R50-R55 R58-R61 R63-R67 R71-R75 R77 R79 R81 R83 = common:R-US_R0603_32; VALUE: 1k
R20 R62 = common:R-US_R0603_31; VALUE: 220
R21 R22 R56 R57 = common:R-US_R0603_33
R85-R87 = common:R-US_R0603_33; VALUE: 100k
SW1 = common:PVB6
SW2 SW3 = common:PVB6_5
SW4-SW9 = common:TAC_SWITCHPTH